# Altium project Kasil_DIOT_x86_board.PrjPcb (part 1 of 4)
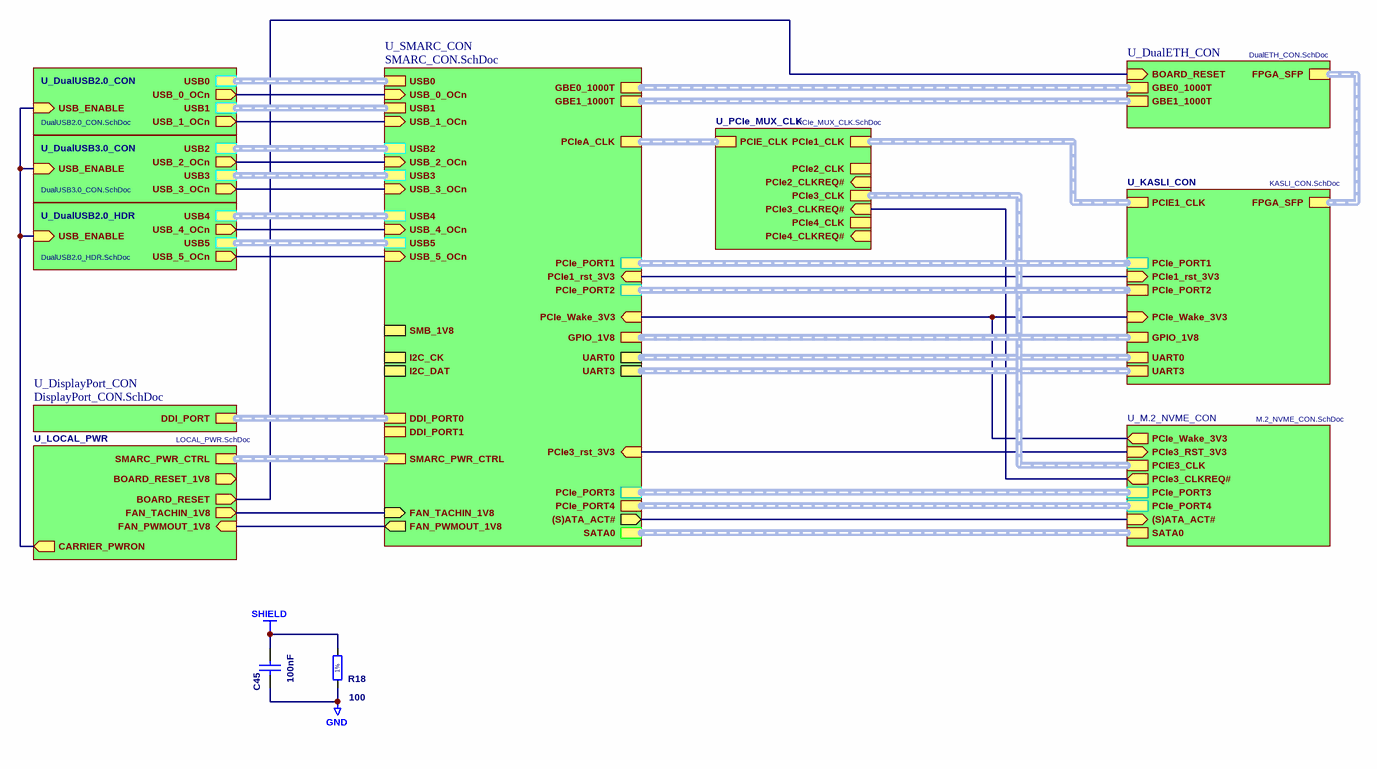
[diagram p0: Kasil_DIOT_x86_board.SchDoc]
11 sheets, 359 parts. Net scope: hierarchical (ports join the sheet entries above them; power ports are global).
Board file: KASLI-DIOT-CPU.PcbDoc
Sheets:
  Kasil_DIOT_x86_board.SchDoc
    U_SMARC_CON = SMARC_CON.SchDoc
    U_DisplayPort_CON = DisplayPort_CON.SchDoc
    U_DualETH_CON = DualETH_CON.SchDoc
    U_DualUSB2.0_CON = DualUSB2.0_CON.SchDoc
    U_DualUSB3.0_CON = DualUSB3.0_CON.SchDoc
    U_LOCAL_PWR = LOCAL_PWR.SchDoc
    U_KASLI_CON = KASLI_CON.SchDoc
    U_M.2_NVME_CON = M.2_NVME_CON.SchDoc
    U_PCIe_MUX_CLK = PCIe_MUX_CLK.SchDoc
    U_DualUSB2.0_HDR = DualUSB2.0_HDR.SchDoc

## Sheet Kasil_DIOT_x86_board.SchDoc
size 420 x 297 mm; SheetNumber: 1; SheetTotal: 11; ModifiedBy: -; CheckedDate: -; Title2: Title 2; DivGrp: WUT ISE; Designer: G.Kasprowicz

### Parts
C45  100nF  [CAPC1005X55N]
R18  100  [RESC1005X40N]

### Sub-sheets
U_DisplayPort_CON = DisplayPort_CON.SchDoc: DDI_PORT (harness DDI_PORT)
U_DualETH_CON = DualETH_CON.SchDoc: GBE0_1000T (harness GBE_copper), GBE1_1000T (harness GBE_copper), FPGA_SFP (harness SFP), BOARD_RESET (in)
U_DualUSB2.0_CON = DualUSB2.0_CON.SchDoc: USB_0_OCn (out), USB1 (harness USB2.0), USB0 (harness USB2.0), USB_1_OCn (out), USB_ENABLE (in)
U_DualUSB2.0_HDR = DualUSB2.0_HDR.SchDoc: USB_5_OCn (out), USB4 (harness USB2.0), USB5 (harness USB2.0), USB_4_OCn (out), USB_ENABLE (in)
U_DualUSB3.0_CON = DualUSB3.0_CON.SchDoc: USB_3_OCn (out), USB3 (harness USB3.0), USB2 (harness USB3.0), USB_2_OCn (out), USB_ENABLE (in)
U_KASLI_CON = KASLI_CON.SchDoc: UART0 (harness UART), UART3 (harness UART), GPIO_1V8 (harness GPIO), PCIE1_CLK (harness CLOCK_DIFF), PCIe_PORT1 (harness PCIe_port), PCIe_PORT2 (harness PCIe_port), FPGA_SFP (harness SFP), PCIe1_rst_3V3 (in), PCIe_Wake_3V3 (in)
U_LOCAL_PWR = LOCAL_PWR.SchDoc: SMARC_PWR_CTRL (harness SMARC_PWR_CTRL), BOARD_RESET (out), BOARD_RESET_1V8 (out), FAN_TACHIN_1V8 (out), FAN_PWMOUT_1V8 (in), CARRIER_PWRON (out)
U_M.2_NVME_CON = M.2_NVME_CON.SchDoc: PCIe3_RST_3V3 (in), PCIe_PORT3 (harness PCIe_port), PCIE3_CLK (harness CLOCK_DIFF), PCIe_PORT4 (harness PCIe_port), PCIe3_CLKREQ# (out), SATA0 (harness SATA), (S)ATA_ACT# (in), PCIe_Wake_3V3 (out)
U_PCIe_MUX_CLK = PCIe_MUX_CLK.SchDoc: PCIE_CLK (harness CLOCK_DIFF), PCIe1_CLK (harness CLOCK_DIFF), PCIe2_CLK (harness CLOCK_DIFF), PCIe3_CLK (harness CLOCK_DIFF), PCIe4_CLK (harness CLOCK_DIFF), PCIe2_CLKREQ# (in), PCIe3_CLKREQ# (in), PCIe4_CLKREQ# (in)
U_SMARC_CON = SMARC_CON.SchDoc: I2C_CK, I2C_DAT, SMB_1V8 (harness SMB), USB_3_OCn (in), USB_0_OCn (in), USB_5_OCn (in), (S)ATA_ACT# (out), USB4 (harness USB2.0), USB5 (harness USB2.0), USB_1_OCn (in), USB_2_OCn (in), USB_4_OCn (in), UART3 (harness UART), UART0 (harness UART), FAN_TACHIN_1V8 (in), FAN_PWMOUT_1V8 (out), PCIe_PORT1 (harness PCIe_port), PCIe_PORT2 (harness PCIe_port), PCIe_PORT3 (harness PCIe_port), USB3 (harness USB3.0), USB2 (harness USB3.0), GBE0_1000T (harness GBE_copper), SATA0 (harness SATA), DDI_PORT0 (harness DDI_PORT), DDI_PORT1 (harness DDI_PORT), SMARC_PWR_CTRL (harness SMARC_PWR_CTRL), GBE1_1000T (harness GBE_copper), PCIeA_CLK (harness CLOCK_DIFF), PCIe_PORT4 (harness PCIe_port), USB0 (harness USB2.0), USB1 (harness USB2.0), PCIe1_rst_3V3 (in), PCIe_Wake_3V3 (in), PCIe3_rst_3V3 (in), GPIO_1V8 (harness GPIO)

### Nets
GND: C45.1 R18.1
SHIELD: C45.2 R18.2
(S)ATA_ACT#: sheet U_SMARC_CON/(S)ATA_ACT#, sheet U_M.2_NVME_CON/(S)ATA_ACT#
BOARD_RESET: sheet U_DualETH_CON/BOARD_RESET, sheet U_LOCAL_PWR/BOARD_RESET
CARRIER_PWRON: sheet U_DualUSB2.0_CON/USB_ENABLE, sheet U_DualUSB3.0_CON/USB_ENABLE, sheet U_LOCAL_PWR/CARRIER_PWRON, sheet U_DualUSB2.0_HDR/USB_ENABLE
PCIe1_rst_3V3: sheet U_SMARC_CON/PCIe1_rst_3V3, sheet U_KASLI_CON/PCIe1_rst_3V3
PCIe3_CLKREQ#: sheet U_M.2_NVME_CON/PCIe3_CLKREQ#, sheet U_PCIe_MUX_CLK/PCIe3_CLKREQ#
PCIe3_RST: sheet U_SMARC_CON/PCIe3_rst_3V3, sheet U_M.2_NVME_CON/PCIe3_RST_3V3
PCIe_Wake_3V3: sheet U_SMARC_CON/PCIe_Wake_3V3, sheet U_KASLI_CON/PCIe_Wake_3V3, sheet U_M.2_NVME_CON/PCIe_Wake_3V3
USB_0_OCn: sheet U_SMARC_CON/USB_0_OCn, sheet U_DualUSB2.0_CON/USB_0_OCn
USB_1_OCn: sheet U_SMARC_CON/USB_1_OCn, sheet U_DualUSB2.0_CON/USB_1_OCn
USB_2_OCn: sheet U_SMARC_CON/USB_2_OCn, sheet U_DualUSB3.0_CON/USB_2_OCn
USB_3_OCn: sheet U_SMARC_CON/USB_3_OCn, sheet U_DualUSB3.0_CON/USB_3_OCn
USB_5_OCn: sheet U_SMARC_CON/USB_5_OCn, sheet U_DualUSB2.0_HDR/USB_5_OCn
NetIC14_5: sheet U_SMARC_CON/USB_4_OCn, sheet U_DualUSB2.0_HDR/USB_4_OCn
NetM1_P113: sheet U_SMARC_CON/FAN_PWMOUT_1V8, sheet U_LOCAL_PWR/FAN_PWMOUT_1V8
NetM1_P114: sheet U_SMARC_CON/FAN_TACHIN_1V8, sheet U_LOCAL_PWR/FAN_TACHIN_1V8

### Buses and harness runs
harness sheet U_DisplayPort_CON/DDI_PORT = sheet U_SMARC_CON/DDI_PORT0
harness sheet U_DualETH_CON/FPGA_SFP = sheet U_KASLI_CON/FPGA_SFP
harness sheet U_DualETH_CON/GBE0_1000T = sheet U_SMARC_CON/GBE0_1000T
harness sheet U_DualETH_CON/GBE1_1000T = sheet U_SMARC_CON/GBE1_1000T
harness sheet U_DualUSB2.0_CON/USB0 = sheet U_SMARC_CON/USB0
harness sheet U_DualUSB2.0_CON/USB1 = sheet U_SMARC_CON/USB1
harness sheet U_DualUSB2.0_HDR/USB4 = sheet U_SMARC_CON/USB4
harness sheet U_DualUSB2.0_HDR/USB5 = sheet U_SMARC_CON/USB5
harness sheet U_DualUSB3.0_CON/USB2 = sheet U_SMARC_CON/USB2
harness sheet U_DualUSB3.0_CON/USB3 = sheet U_SMARC_CON/USB3
harness sheet U_KASLI_CON/GPIO_1V8 = sheet U_SMARC_CON/GPIO_1V8
harness sheet U_KASLI_CON/PCIE1_CLK = sheet U_PCIe_MUX_CLK/PCIe1_CLK
harness sheet U_KASLI_CON/PCIe_PORT1 = sheet U_SMARC_CON/PCIe_PORT1
harness sheet U_KASLI_CON/PCIe_PORT2 = sheet U_SMARC_CON/PCIe_PORT2
harness sheet U_KASLI_CON/UART0 = sheet U_SMARC_CON/UART0
harness sheet U_KASLI_CON/UART3 = sheet U_SMARC_CON/UART3
harness sheet U_LOCAL_PWR/SMARC_PWR_CTRL = sheet U_SMARC_CON/SMARC_PWR_CTRL
harness sheet U_M.2_NVME_CON/PCIE3_CLK = sheet U_PCIe_MUX_CLK/PCIe3_CLK
harness sheet U_M.2_NVME_CON/PCIe_PORT3 = sheet U_SMARC_CON/PCIe_PORT3
harness sheet U_M.2_NVME_CON/PCIe_PORT4 = sheet U_SMARC_CON/PCIe_PORT4
harness sheet U_M.2_NVME_CON/SATA0 = sheet U_SMARC_CON/SATA0
harness sheet U_PCIe_MUX_CLK/PCIE_CLK = sheet U_SMARC_CON/PCIeA_CLK

### Notes on the sheet
- Project/Equipment
- Document
- Designer
- Drawn by
- Check.by
- Copyright WUT ISE 2024.
  This documentation describes Open Hardware and is licensed under the CERN OHL v.2. You may redistribute and modify this documentation under the terms of the CERN OHL v.2. (http://ohwr.org/CERNOHL). This documentation is distributed WITHOUT ANY EXPRESS OR IMPLIED WARRANTY, INCLUDING OF MERCHANTABILITY, SATISFACTORY QUALITY AND FITNESS FOR A PARTICULAR PURPOSE. Please see the CERN OHL v.2 for applicable conditions.
- Contact
- File
- Last Mod.
- Print Date
- Sheet
- Size
- A3
- of
- Rev
- (in symbol R0402_100R_1%_0.0625W_100PPM) 1%

### Library data of the parts
C45 = CC0402_100NF_16V_10%_X7R: Non-polarised capacitor; Part Description: SMD Multilayer Chip Ceramic Capacitor; Manufacturer: GENERIC; Manufacturer1 Part Number: GRM155R71C104KA88D; Voltage: 16V; TC: X7R; Tolerance: ±10%; Part Number: CC0402_100NF_16V_10%_X7R; Component Kind: Standard; Component Type: Standard; Pin Count: 2; Value: 100nF; Status: Not Recommended; Manufacturer Part Number: CC0402_100NF_16V_10%_X7R; Case: 0402; Mounted: Yes; Socket: No; SMD: Yes; Sense: No; Manufacturer1 Example: MURATA; Manufacturer1 ComponentHeight: 0.55mm; HelpURL: \\cern.ch\dfs\Applications\Altium\Datasheets\CC0402_X7R_MURATA_GRM.pdf; Author: CERN DEM JLC; CreateDate: 05/12/2013; LatestRevisionDate: 03/12/2007
R18 = R0402_100R_1%_0.0625W_100PPM: Resistor - 1%; Part Description: General Purpose Thick Film Chip Resistor; Manufacturer: GENERIC; Manufacturer1 Part Number: 232270671001L; TC: ±100ppm/°C; Table: Resistors SMD; Part Number: R0402_100R_1%_0.0625W_100PPM; Component Kind: Standard; Component Type: Standard; Pin Count: 2; Value: 100; Status: Not recommended; Power: 0.0625W; Tolerance: ±1%; Manufacturer Part Number: R0402_100R_1%_0.0625W_100PPM; Case: 0402; Mounted: Yes; Socket: No; SMD: Yes; Manufacturer1 Example: YAGEO PHYCOMP; Manufacturer1 ComponentHeight: 0.4mm; HelpURL: \\cern.ch\dfs\Applications\Altium\Datasheets\R0402_Phycomp_RC0402.pdf; Author: CERN DEM JLC; CreateDate: 2007-12-03; LatestRevisionDate: 2012-10-17

## Sheet SMARC_CON.SchDoc
size 420 x 297 mm; SheetNumber: 2; SheetTotal: 11; ModifiedBy: -; CheckedDate: -; Title2: Title 2; DivGrp: WUT ISE; Designer: A. Bartkowicz
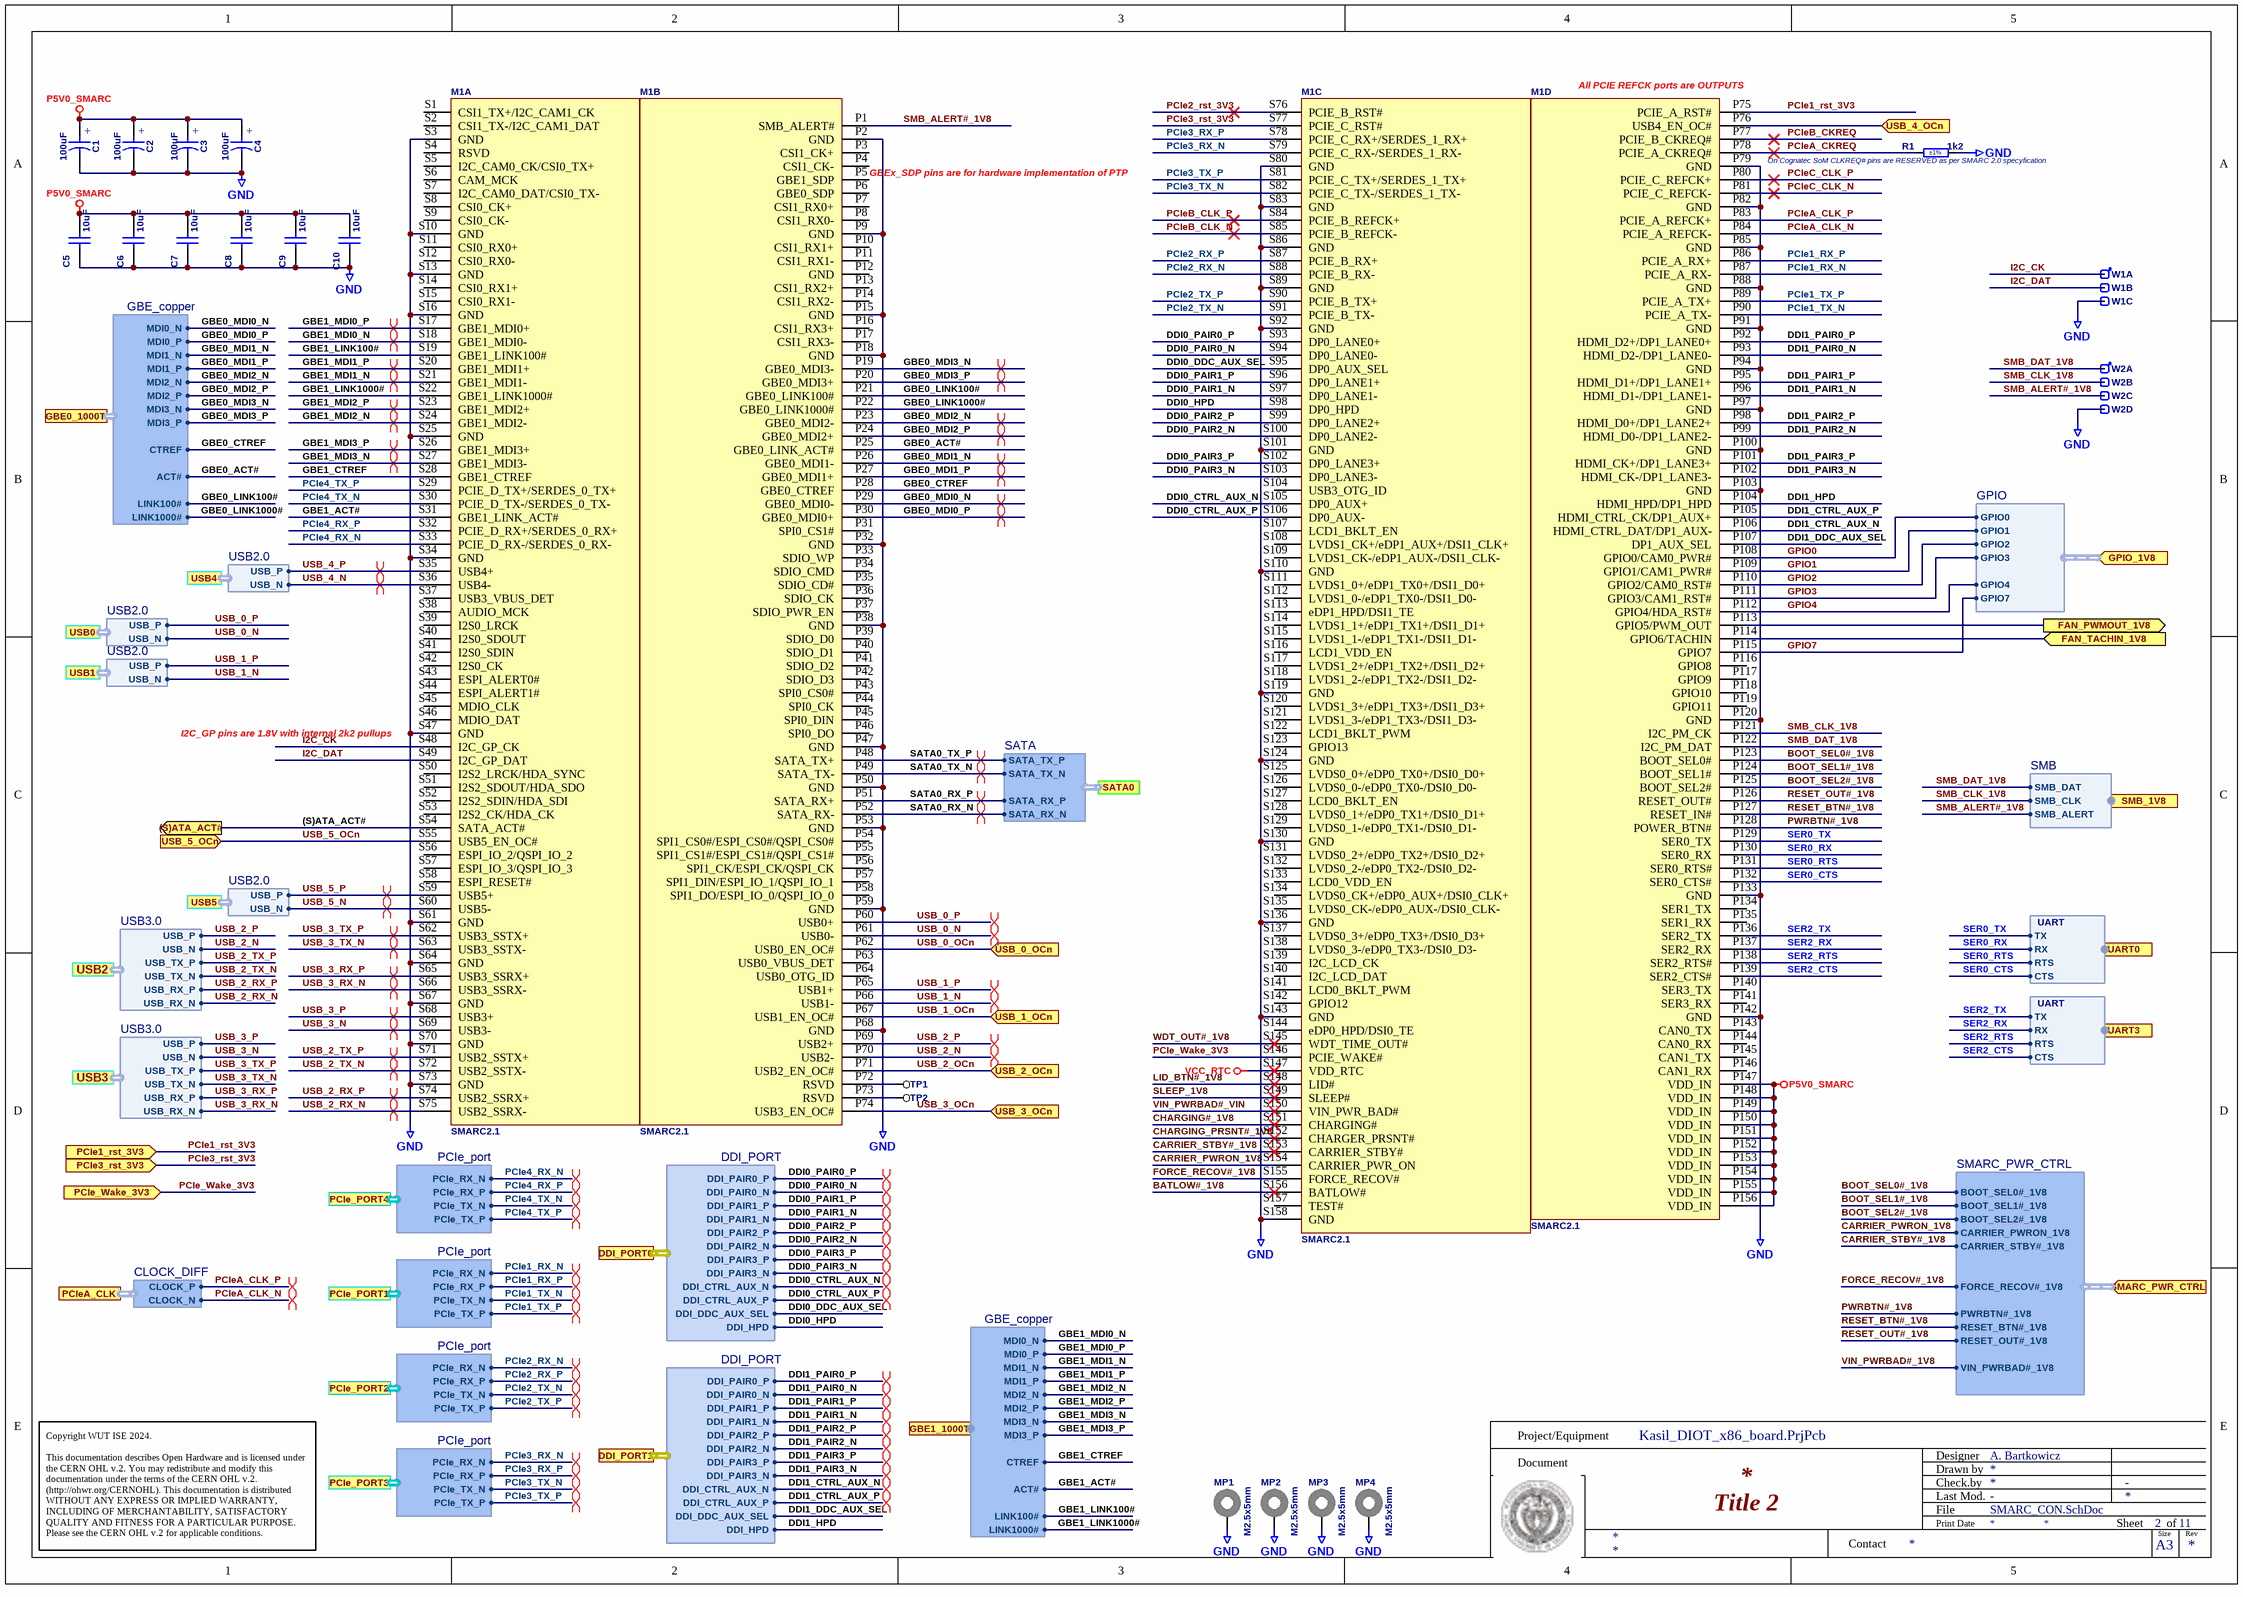
[diagram p1: SMARC_CON.SchDoc]

### Parts
C1  100uF  [CAPMP7343X310N]
C2  100uF  [CAPMP7343X310N]
C3  100uF  [CAPMP7343X310N]
C4  100uF  [CAPMP7343X310N]
C5  10uF  [CAPC1608X80N]
C6  10uF  [CAPC1608X80N]
C7  10uF  [CAPC1608X80N]
C8  10uF  [CAPC1608X80N]
C9  10uF  [CAPC1608X80N]
C10  10uF  [CAPC1608X80N]
M1  SMARC2.1  [SMARC2.1]  (parts A,B,C,D of 4)
MP1  M2.5x5mm  [9774025151]
MP2  M2.5x5mm  [9774025151]
MP3  M2.5x5mm  [9774025151]
MP4  M2.5x5mm  [9774025151]
R1  1k2  Tolerance: ±1%  [RESC1005X40N]
TP1  TP  [TP_large]  (value not drawn)
TP2  TP  [TP_large]  (value not drawn)
W1  Header 3  [SAMTEC_TSW-103-23-L-S]  (value not drawn)  (parts A,B,C of 3)
W2  Header 4  [SAMTEC_TSW-104-23-L-S]  (value not drawn)  (parts A,B,C,D of 4)

### Ports
(S)ATA_ACT# (out), DDI_PORT0 (harness DDI_PORT), DDI_PORT1 (harness DDI_PORT), FAN_PWMOUT_1V8 (out), FAN_TACHIN_1V8 (in), GBE0_1000T (harness GBE_copper), GBE1_1000T (harness GBE_copper), GPIO_1V8 (in, harness GPIO), PCIe1_rst_3V3 (in), PCIe3_rst_3V3 (in), PCIe_PORT1 (harness PCIe_port), PCIe_PORT2 (harness PCIe_port), PCIe_PORT3 (harness PCIe_port), PCIe_PORT4 (harness PCIe_port), PCIe_Wake_3V3 (in), PCIeA_CLK (harness CLOCK_DIFF), SATA0 (harness SATA), SMARC_PWR_CTRL (in, harness SMARC_PWR_CTRL), SMB_1V8 (in, harness SMB), UART0 (harness UART), UART3 (harness UART), USB0 (harness USB2.0), USB1 (harness USB2.0), USB2 (harness USB3.0), USB3 (harness USB3.0), USB4 (harness USB2.0), USB5 (harness USB2.0), USB_0_OCn (in), USB_1_OCn (in), USB_2_OCn (in), USB_3_OCn (in), USB_4_OCn (in), USB_5_OCn (in)

### Harnesses
USB2.0: USB_P, USB_N
CLOCK_DIFF: CLOCK_P, CLOCK_N
PCIe_port: PCIe_TX_P, PCIe_TX_N, PCIe_RX_P, PCIe_RX_N
USB3.0: USB_P, USB_N, USB_TX_P, USB_TX_N, USB_RX_P, USB_RX_N
GBE_copper: MDI2_P, MDI3_N, MDI2_N, MDI3_P, MDI1_P, MDI0_N, MDI1_N, MDI0_P, ACT#, LINK100#, LINK1000#, CTREF
SATA: SATA_TX_N, SATA_TX_P, SATA_RX_N, SATA_RX_P
DDI_PORT: DDI_PAIR0_P, DDI_PAIR0_N, DDI_PAIR1_P, DDI_PAIR1_N, DDI_PAIR2_P, DDI_PAIR2_N, DDI_CTRL_AUX_N, DDI_CTRL_AUX_P, DDI_DDC_AUX_SEL, DDI_HPD, DDI_PAIR3_P, DDI_PAIR3_N
SMARC_PWR_CTRL: BOOT_SEL0#_1V8, BOOT_SEL1#_1V8, BOOT_SEL2#_1V8, CARRIER_PWRON_1V8, CARRIER_STBY#_1V8, FORCE_RECOV#_1V8, PWRBTN#_1V8, RESET_BTN#_1V8, RESET_OUT#_1V8, VIN_PWRBAD#_1V8
UART: TX, RX, RTS, CTS
SMB: SMB_DAT, SMB_CLK, SMB_ALERT
GPIO: GPIO0, GPIO1, GPIO2, GPIO3, GPIO4, GPIO7

### Nets
GND: C1.2 C2.2 C3.2 C4.2 C5.1 C6.1 C7.1 C8.1 C9.1 C10.1 M1.P2(GND) M1.P9(GND) M1.P15(GND) M1.P18(GND) M1.P32(GND) M1.P38(GND) M1.P47(GND) M1.P50(GND) M1.P53(GND) M1.P59(GND) M1.P68(GND) M1.P79(GND) M1.P82(GND) M1.P85(GND) M1.P88(GND) M1.P91(GND) M1.P94(GND) M1.P97(GND) M1.P100(GND) M1.P103(GND) M1.P120(GND) M1.P133(GND) M1.P142(GND) M1.S3(GND) M1.S10(GND) M1.S13(GND) M1.S16(GND) M1.S25(GND) M1.S34(GND) M1.S47(GND) M1.S61(GND) M1.S64(GND) M1.S67(GND) M1.S70(GND) M1.S73(GND) M1.S80(GND) M1.S83(GND) M1.S86(GND) M1.S89(GND) M1.S92(GND) M1.S101(GND) M1.S110(GND) M1.S119(GND) M1.S124(GND) M1.S130(GND) M1.S136(GND) M1.S143(GND) M1.S158(GND) MP1.1 MP2.1 MP3.1 MP4.1 R1.2 W1.3 W2.4
P5V0_SMARC: C1.1 C2.1 C3.1 C4.1 C5.2 C6.2 C7.2 C8.2 C9.2 C10.2 M1.P147(VDD_IN) M1.P148(VDD_IN) M1.P149(VDD_IN) M1.P150(VDD_IN) M1.P151(VDD_IN) M1.P152(VDD_IN) M1.P153(VDD_IN) M1.P154(VDD_IN) M1.P155(VDD_IN) M1.P156(VDD_IN)
VCC_RTC: M1.S147(VDD_RTC)
(S)ATA_ACT#: M1.S54(SATA_ACT#) ; port (S)ATA_ACT#
BATLOW#_1V8: M1.S156(BATLOW#)
BOOT_SEL0#_1V8: M1.P123(BOOT_SEL0#) ; port SMARC_PWR_CTRL.BOOT_SEL0#_1V8
BOOT_SEL1#_1V8: M1.P124(BOOT_SEL1#) ; port SMARC_PWR_CTRL.BOOT_SEL1#_1V8
BOOT_SEL2#_1V8: M1.P125(BOOT_SEL2#) ; port SMARC_PWR_CTRL.BOOT_SEL2#_1V8
CARRIER_PWRON_1V8: M1.S154(CARRIER_PWR_ON) ; port SMARC_PWR_CTRL.CARRIER_PWRON_1V8
CARRIER_STBY#_1V8: M1.S153(CARRIER_STBY#) ; port SMARC_PWR_CTRL.CARRIER_STBY#_1V8
CHARGING#_1V8: M1.S151(CHARGING#)
CHARGING_PRSNT#_1V8: M1.S152(CHARGER_PRSNT#)
DDI0_CTRL_AUX_N: M1.S105(DP0_AUX+) ; port DDI_PORT0.DDI_CTRL_AUX_N
DDI0_CTRL_AUX_P: M1.S106(DP0_AUX-) ; port DDI_PORT0.DDI_CTRL_AUX_P
DDI0_DDC_AUX_SEL: M1.S95(DP0_AUX_SEL) ; port DDI_PORT0.DDI_DDC_AUX_SEL
DDI0_HPD: M1.S98(DP0_HPD) ; port DDI_PORT0.DDI_HPD
DDI0_PAIR0_N: M1.S94(DP0_LANE0-) ; port DDI_PORT0.DDI_PAIR0_N
DDI0_PAIR0_P: M1.S93(DP0_LANE0+) ; port DDI_PORT0.DDI_PAIR0_P
DDI0_PAIR1_N: M1.S97(DP0_LANE1-) ; port DDI_PORT0.DDI_PAIR1_N
DDI0_PAIR1_P: M1.S96(DP0_LANE1+) ; port DDI_PORT0.DDI_PAIR1_P
DDI0_PAIR2_N: M1.S100(DP0_LANE2-) ; port DDI_PORT0.DDI_PAIR2_N
DDI0_PAIR2_P: M1.S99(DP0_LANE2+) ; port DDI_PORT0.DDI_PAIR2_P
DDI0_PAIR3_N: M1.S103(DP0_LANE3-) ; port DDI_PORT0.DDI_PAIR3_N
DDI0_PAIR3_P: M1.S102(DP0_LANE3+) ; port DDI_PORT0.DDI_PAIR3_P
DDI1_CTRL_AUX_N: M1.P106(HDMI_CTRL_DAT/DP1_AUX-) ; port DDI_PORT1.DDI_CTRL_AUX_N
DDI1_CTRL_AUX_P: M1.P105(HDMI_CTRL_CK/DP1_AUX+) ; port DDI_PORT1.DDI_CTRL_AUX_P
DDI1_DDC_AUX_SEL: M1.P107(DP1_AUX_SEL) ; port DDI_PORT1.DDI_DDC_AUX_SEL
DDI1_HPD: M1.P104(HDMI_HPD/DP1_HPD) ; port DDI_PORT1.DDI_HPD
DDI1_PAIR0_N: M1.P93(HDMI_D2-/DP1_LANE0-) ; port DDI_PORT1.DDI_PAIR0_N
DDI1_PAIR0_P: M1.P92(HDMI_D2+/DP1_LANE0+) ; port DDI_PORT1.DDI_PAIR0_P
DDI1_PAIR1_N: M1.P96(HDMI_D1-/DP1_LANE1-) ; port DDI_PORT1.DDI_PAIR1_N
DDI1_PAIR1_P: M1.P95(HDMI_D1+/DP1_LANE1+) ; port DDI_PORT1.DDI_PAIR1_P
DDI1_PAIR2_N: M1.P99(HDMI_D0-/DP1_LANE2-) ; port DDI_PORT1.DDI_PAIR2_N
DDI1_PAIR2_P: M1.P98(HDMI_D0+/DP1_LANE2+) ; port DDI_PORT1.DDI_PAIR2_P
DDI1_PAIR3_N: M1.P102(HDMI_CK-/DP1_LANE3-) ; port DDI_PORT1.DDI_PAIR3_N
DDI1_PAIR3_P: M1.P101(HDMI_CK+/DP1_LANE3+) ; port DDI_PORT1.DDI_PAIR3_P
FORCE_RECOV#_1V8: M1.S155(FORCE_RECOV#) ; port SMARC_PWR_CTRL.FORCE_RECOV#_1V8
GBE0_ACT#: M1.P25(GBE0_LINK_ACT#) ; port GBE0_1000T.ACT#
GBE0_CTREF: M1.P28(GBE0_CTREF) ; port GBE0_1000T.CTREF
GBE0_LINK100#: M1.P21(GBE0_LINK100#) ; port GBE0_1000T.LINK100#
GBE0_LINK1000#: M1.P22(GBE0_LINK1000#) ; port GBE0_1000T.LINK1000#
GBE0_MDI0_N: M1.P29(GBE0_MDI0-) ; port GBE0_1000T.MDI0_N
GBE0_MDI0_P: M1.P30(GBE0_MDI0+) ; port GBE0_1000T.MDI0_P
GBE0_MDI1_N: M1.P26(GBE0_MDI1-) ; port GBE0_1000T.MDI1_N
GBE0_MDI1_P: M1.P27(GBE0_MDI1+) ; port GBE0_1000T.MDI1_P
GBE0_MDI2_N: M1.P23(GBE0_MDI2-) ; port GBE0_1000T.MDI2_N
GBE0_MDI2_P: M1.P24(GBE0_MDI2+) ; port GBE0_1000T.MDI2_P
GBE0_MDI3_N: M1.P19(GBE0_MDI3-) ; port GBE0_1000T.MDI3_N
GBE0_MDI3_P: M1.P20(GBE0_MDI3+) ; port GBE0_1000T.MDI3_P
GBE1_ACT#: M1.S31(GBE1_LINK_ACT#) ; port GBE1_1000T.ACT#
GBE1_CTREF: M1.S28(GBE1_CTREF) ; port GBE1_1000T.CTREF
GBE1_LINK100#: M1.S19(GBE1_LINK100#) ; port GBE1_1000T.LINK100#
GBE1_LINK1000#: M1.S22(GBE1_LINK1000#) ; port GBE1_1000T.LINK1000#
GBE1_MDI0_N: M1.S18(GBE1_MDI0-) ; port GBE1_1000T.MDI0_N
GBE1_MDI0_P: M1.S17(GBE1_MDI0+) ; port GBE1_1000T.MDI0_P
GBE1_MDI1_N: M1.S21(GBE1_MDI1-) ; port GBE1_1000T.MDI1_N
GBE1_MDI1_P: M1.S20(GBE1_MDI1+) ; port GBE1_1000T.MDI1_P
GBE1_MDI2_N: M1.S24(GBE1_MDI2-) ; port GBE1_1000T.MDI2_N
GBE1_MDI2_P: M1.S23(GBE1_MDI2+) ; port GBE1_1000T.MDI2_P
GBE1_MDI3_N: M1.S27(GBE1_MDI3-) ; port GBE1_1000T.MDI3_N
GBE1_MDI3_P: M1.S26(GBE1_MDI3+) ; port GBE1_1000T.MDI3_P
GPIO0: M1.P108(GPIO0/CAM0_PWR#) ; port GPIO_1V8.GPIO0
GPIO1: M1.P109(GPIO1/CAM1_PWR#) ; port GPIO_1V8.GPIO1
GPIO2: M1.P110(GPIO2/CAM0_RST#) ; port GPIO_1V8.GPIO2
GPIO3: M1.P111(GPIO3/CAM1_RST#) ; port GPIO_1V8.GPIO3
GPIO4: M1.P112(GPIO4/HDA_RST#) ; port GPIO_1V8.GPIO4
GPIO7: M1.P115(GPIO7) ; port GPIO_1V8.GPIO7
I2C_CK: M1.S48(I2C_GP_CK) W1.1
I2C_DAT: M1.S49(I2C_GP_DAT) W1.2
LID_BTN#_1V8: M1.S148(LID#)
PCIe1_rst_3V3: M1.P75(PCIE_A_RST#) ; port PCIe1_rst_3V3
PCIe1_RX_N: M1.P87(PCIE_A_RX-) ; port PCIe_PORT1.PCIe_RX_N
PCIe1_RX_P: M1.P86(PCIE_A_RX+) ; port PCIe_PORT1.PCIe_RX_P
PCIe1_TX_N: M1.P90(PCIE_A_TX-) ; port PCIe_PORT1.PCIe_TX_N
PCIe1_TX_P: M1.P89(PCIE_A_TX+) ; port PCIe_PORT1.PCIe_TX_P
PCIe2_rst_3V3: M1.S76(PCIE_B_RST#)
PCIe2_RX_N: M1.S88(PCIE_B_RX-) ; port PCIe_PORT2.PCIe_RX_N
PCIe2_RX_P: M1.S87(PCIE_B_RX+) ; port PCIe_PORT2.PCIe_RX_P
PCIe2_TX_N: M1.S91(PCIE_B_TX-) ; port PCIe_PORT2.PCIe_TX_N
PCIe2_TX_P: M1.S90(PCIE_B_TX+) ; port PCIe_PORT2.PCIe_TX_P
PCIe3_rst_3V3: M1.S77(PCIE_C_RST#) ; port PCIe3_rst_3V3  [project net PCIe3_RST]
PCIe3_RX_N: M1.S79(PCIE_C_RX-/SERDES_1_RX-) ; port PCIe_PORT3.PCIe_RX_N
PCIe3_RX_P: M1.S78(PCIE_C_RX+/SERDES_1_RX+) ; port PCIe_PORT3.PCIe_RX_P
PCIe3_TX_N: M1.S82(PCIE_C_TX-/SERDES_1_TX-) ; port PCIe_PORT3.PCIe_TX_N
PCIe3_TX_P: M1.S81(PCIE_C_TX+/SERDES_1_TX+) ; port PCIe_PORT3.PCIe_TX_P
PCIe4_RX_N: M1.S33(PCIE_D_RX-/SERDES_0_RX-) ; port PCIe_PORT4.PCIe_RX_N
PCIe4_RX_P: M1.S32(PCIE_D_RX+/SERDES_0_RX+) ; port PCIe_PORT4.PCIe_RX_P
PCIe4_TX_N: M1.S30(PCIE_D_TX-/SERDES_0_TX-) ; port PCIe_PORT4.PCIe_TX_N
PCIe4_TX_P: M1.S29(PCIE_D_TX+/SERDES_0_TX+) ; port PCIe_PORT4.PCIe_TX_P
PCIe_Wake_3V3: M1.S146(PCIE_WAKE#) ; port PCIe_Wake_3V3
PCIeA_CKREQ: M1.P78(PCIE_A_CKREQ#) R1.1
PCIeA_CLK_N: M1.P84(PCIE_A_REFCK-) ; port PCIeA_CLK.CLOCK_N  [project net PCIe_CLK_N]
PCIeA_CLK_P: M1.P83(PCIE_A_REFCK+) ; port PCIeA_CLK.CLOCK_P  [project net PCIe_CLK_P]
PCIeB_CKREQ: M1.P77(PCIE_B_CKREQ#)
PCIeB_CLK_N: M1.S85(PCIE_B_REFCK-)
PCIeB_CLK_P: M1.S84(PCIE_B_REFCK+)
PCIeC_CLK_N: M1.P81(PCIE_C_REFCK-)
PCIeC_CLK_P: M1.P80(PCIE_C_REFCK+)
PWRBTN#_1V8: M1.P128(POWER_BTN#) ; port SMARC_PWR_CTRL.PWRBTN#_1V8
RESET_BTN#_1V8: M1.P127(RESET_IN#) ; port SMARC_PWR_CTRL.RESET_BTN#_1V8
RESET_OUT#_1V8: M1.P126(RESET_OUT#) ; port SMARC_PWR_CTRL.RESET_OUT#_1V8
SATA0_RX_N: M1.P52(SATA_RX-) ; port SATA0.SATA_RX_N
SATA0_RX_P: M1.P51(SATA_RX+) ; port SATA0.SATA_RX_P
SATA0_TX_N: M1.P49(SATA_TX-) ; port SATA0.SATA_TX_N
SATA0_TX_P: M1.P48(SATA_TX+) ; port SATA0.SATA_TX_P
SER0_CTS: M1.P132(SER0_CTS#) ; port UART0.CTS
SER0_RTS: M1.P131(SER0_RTS#) ; port UART0.RTS
SER0_RX: M1.P130(SER0_RX) ; port UART0.RX
SER0_TX: M1.P129(SER0_TX) ; port UART0.TX
SER2_CTS: M1.P139(SER2_CTS#) ; port UART3.CTS
SER2_RTS: M1.P138(SER2_RTS#) ; port UART3.RTS
SER2_RX: M1.P137(SER2_RX) ; port UART3.RX
SER2_TX: M1.P136(SER2_TX) ; port UART3.TX
SLEEP_1V8: M1.S149(SLEEP#)
SMB_ALERT#_1V8: M1.P1(SMB_ALERT#) W2.3 ; port SMB_1V8.SMB_ALERT
SMB_CLK_1V8: M1.P121(I2C_PM_CK) W2.2 ; port SMB_1V8.SMB_CLK
SMB_DAT_1V8: M1.P122(I2C_PM_DAT) W2.1 ; port SMB_1V8.SMB_DAT
USB_0_N: M1.P61(USB0-) ; port USB0.USB_N
USB_0_OCn: M1.P62(USB0_EN_OC#) ; port USB_0_OCn
USB_0_P: M1.P60(USB0+) ; port USB0.USB_P
USB_1_N: M1.P66(USB1-) ; port USB1.USB_N
USB_1_OCn: M1.P67(USB1_EN_OC#) ; port USB_1_OCn
USB_1_P: M1.P65(USB1+) ; port USB1.USB_P
USB_2_N: M1.P70(USB2-) ; port USB2.USB_N
USB_2_OCn: M1.P71(USB2_EN_OC#) ; port USB_2_OCn
USB_2_P: M1.P69(USB2+) ; port USB2.USB_P
USB_2_RX_N: M1.S75(USB2_SSRX-) ; port USB2.USB_RX_N
USB_2_RX_P: M1.S74(USB2_SSRX+) ; port USB2.USB_RX_P
USB_2_TX_N: M1.S72(USB2_SSTX-) ; port USB2.USB_TX_N
USB_2_TX_P: M1.S71(USB2_SSTX+) ; port USB2.USB_TX_P
USB_3_N: M1.S69(USB3-) ; port USB3.USB_N
USB_3_OCn: M1.P74(USB3_EN_OC#) ; port USB_3_OCn
USB_3_P: M1.S68(USB3+) ; port USB3.USB_P
USB_3_RX_N: M1.S66(USB3_SSRX-) ; port USB3.USB_RX_N
USB_3_RX_P: M1.S65(USB3_SSRX+) ; port USB3.USB_RX_P
USB_3_TX_N: M1.S63(USB3_SSTX-) ; port USB3.USB_TX_N
USB_3_TX_P: M1.S62(USB3_SSTX+) ; port USB3.USB_TX_P
USB_4_N: M1.S36(USB4-) ; port USB4.USB_N
USB_4_P: M1.S35(USB4+) ; port USB4.USB_P
USB_5_N: M1.S60(USB5-) ; port USB5.USB_N
USB_5_OCn: M1.S55(USB5_EN_OC#) ; port USB_5_OCn
USB_5_P: M1.S59(USB5+) ; port USB5.USB_P
VIN_PWRBAD#_VIN: M1.S150(VIN_PWR_BAD#)
WDT_OUT#_1V8: M1.S145(WDT_TIME_OUT#)
NetIC14_5: M1.P76(USB4_EN_OC#) ; port USB_4_OCn
NetM1_P72: M1.P72(RSVD) TP1.1
NetM1_P73: M1.P73(RSVD) TP2.1
NetM1_P113: M1.P113(GPIO5/PWM_OUT) ; port FAN_PWMOUT_1V8
NetM1_P114: M1.P114(GPIO6/TACHIN) ; port FAN_TACHIN_1V8

Not connected (* = marked no-connect by the designer): M1 P3(CSI1_CK+) P4(CSI1_CK-) P5(GBE1_SDP) P6(GBE0_SDP) P7(CSI1_RX0+) P8(CSI1_RX0-) P10(CSI1_RX1+) P11(CSI1_RX1-) P12(GND) P13(CSI1_RX2+) P14(CSI1_RX2-) P16(CSI1_RX3+) P17(CSI1_RX3-) P31(SPI0_CS1#) P33(SDIO_WP) P34(SDIO_CMD) P35(SDIO_CD#) P36(SDIO_CK) P37(SDIO_PWR_EN) P39(SDIO_D0) P40(SDIO_D1) P41(SDIO_D2) P42(SDIO_D3) P43(SPI0_CS0#) P44(SPI0_CK) P45(SPI0_DIN) P46(SPI0_DO) P54(SPI1_CS0#/ESPI_CS0#/QSPI_CS0#) P55(SPI1_CS1#/ESPI_CS1#/QSPI_CS1#) P56(SPI1_CK/ESPI_CK/QSPI_CK) P57(SPI1_DIN/ESPI_IO_1/QSPI_IO_1) P58(SPI1_DO/ESPI_IO_0/QSPI_IO_0) P63(USB0_VBUS_DET) P64(USB0_OTG_ID) P116(GPIO8) P117(GPIO9) P118(GPIO10) P119(GPIO11) P134(SER1_TX) P135(SER1_RX) P140(SER3_TX) P141(SER3_RX) P143(CAN0_TX) P144(CAN0_RX) P145(CAN1_TX) P146(CAN1_RX) S1(CSI1_TX+/I2C_CAM1_CK) S2(CSI1_TX-/I2C_CAM1_DAT) S4(RSVD) S5(I2C_CAM0_CK/CSI0_TX+) S6(CAM_MCK) S7(I2C_CAM0_DAT/CSI0_TX-) S8(CSI0_CK+) S9(CSI0_CK-) S11(CSI0_RX0+) S12(CSI0_RX0-) S14(CSI0_RX1+) S15(CSI0_RX1-) S37(USB3_VBUS_DET) S38(AUDIO_MCK) S39(I2S0_LRCK) S40(I2S0_SDOUT) S41(I2S0_SDIN) S42(I2S0_CK) S43(ESPI_ALERT0#) S44(ESPI_ALERT1#) S45(MDIO_CLK) S46(MDIO_DAT) S50(I2S2_LRCK/HDA_SYNC) S51(I2S2_SDOUT/HDA_SDO) S52(I2S2_SDIN/HDA_SDI) S53(I2S2_CK/HDA_CK) S56(ESPI_IO_2/QSPI_IO_2) S57(ESPI_IO_3/QSPI_IO_3) S58(ESPI_RESET#) S104(USB3_OTG_ID) S107(LCD1_BKLT_EN) S108(LVDS1_CK+/eDP1_AUX+/DSI1_CLK+) S109(LVDS1_CK-/eDP1_AUX-/DSI1_CLK-) S111(LVDS1_0+/eDP1_TX0+/DSI1_D0+) S112(LVDS1_0-/eDP1_TX0-/DSI1_D0-) S113(eDP1_HPD/DSI1_TE) S114(LVDS1_1+/eDP1_TX1+/DSI1_D1+) S115(LVDS1_1-/eDP1_TX1-/DSI1_D1-) S116(LCD1_VDD_EN) S117(LVDS1_2+/eDP1_TX2+/DSI1_D2+) S118(LVDS1_2-/eDP1_TX2-/DSI1_D2-) S120(LVDS1_3+/eDP1_TX3+/DSI1_D3+) S121(LVDS1_3-/eDP1_TX3-/DSI1_D3-) S122(LCD1_BKLT_PWM) S123(GPIO13) S125(LVDS0_0+/eDP0_TX0+/DSI0_D0+) S126(LVDS0_0-/eDP0_TX0-/DSI0_D0-) S127(LCD0_BKLT_EN) S128(LVDS0_1+/eDP0_TX1+/DSI0_D1+) S129(LVDS0_1-/eDP0_TX1-/DSI0_D1-) S131(LVDS0_2+/eDP0_TX2+/DSI0_D2+) S132(LVDS0_2-/eDP0_TX2-/DSI0_D2-) S133(LCD0_VDD_EN) S134(LVDS0_CK+/eDP0_AUX+/DSI0_CLK+) S135(LVDS0_CK-/eDP0_AUX-/DSI0_CLK-) S137(LVDS0_3+/eDP0_TX3+/DSI0_D3+) S138(LVDS0_3-/eDP0_TX3-/DSI0_D3-) S139(I2C_LCD_CK) S140(I2C_LCD_DAT) S141(LCD0_BKLT_PWM) S142(GPIO12) S144(eDP0_HPD/DSI0_TE) S157(TEST#)

### Layout directives
differential pair: DDI0_CTRL_AUX_N, DDI0_CTRL_AUX_P, DDI0_PAIR0_N, DDI0_PAIR0_P, DDI0_PAIR1_N, DDI0_PAIR1_P, DDI0_PAIR2_N, DDI0_PAIR2_P, DDI0_PAIR3_N, DDI0_PAIR3_P, DDI1_CTRL_AUX_N, DDI1_CTRL_AUX_P, DDI1_PAIR0_N, DDI1_PAIR0_P, DDI1_PAIR1_N, DDI1_PAIR1_P, DDI1_PAIR2_N, DDI1_PAIR2_P, DDI1_PAIR3_N, DDI1_PAIR3_P, GBE0_MDI0_N, GBE0_MDI0_P, GBE0_MDI1_N, GBE0_MDI1_P, GBE0_MDI2_N, GBE0_MDI2_P, GBE0_MDI3_N, GBE0_MDI3_P, GBE1_MDI0_N, GBE1_MDI0_P, GBE1_MDI1_N, GBE1_MDI1_P, GBE1_MDI2_N, GBE1_MDI2_P, GBE1_MDI3_N, GBE1_MDI3_P, PCIe1_RX_N, PCIe1_RX_P, PCIe1_TX_N, PCIe1_TX_P, PCIe2_RX_N, PCIe2_RX_P, PCIe2_TX_N, PCIe2_TX_P, PCIe3_RX_N, PCIe3_RX_P, PCIe3_TX_N, PCIe3_TX_P, PCIe4_RX_N, PCIe4_RX_P, PCIe4_TX_N, PCIe4_TX_P, PCIe_CLK_N, PCIe_CLK_P, SATA0_RX_N, SATA0_RX_P, SATA0_TX_N, SATA0_TX_P, USB_0_N, USB_0_P, USB_1_N, USB_1_P, USB_2_N, USB_2_P, USB_2_RX_N, USB_2_RX_P, USB_2_TX_N, USB_2_TX_P, USB_3_N, USB_3_P, USB_3_RX_N, USB_3_RX_P, USB_3_TX_N, USB_3_TX_P, USB_4_N, USB_4_P, USB_5_N, USB_5_P

### Notes on the sheet
- (near M1) All PCIE REFCK ports are OUTPUTS
- (near M1) GBEx_SDP pins are for hardware implementation of PTP
- (near R1) On Cognatec SoM CLKREQ# pins are RESERVED as per SMARC 2.0 specyfication
- (near M1) I2C_GP pins are 1.8V with internal 2k2 pullups
- Project/Equipment
- Document
- Designer
- Drawn by
- Check.by
- Copyright WUT ISE 2024.
  This documentation describes Open Hardware and is licensed under the CERN OHL v.2. You may redistribute and modify this documentation under the terms of the CERN OHL v.2. (http://ohwr.org/CERNOHL). This documentation is distributed WITHOUT ANY EXPRESS OR IMPLIED WARRANTY, INCLUDING OF MERCHANTABILITY, SATISFACTORY QUALITY AND FITNESS FOR A PARTICULAR PURPOSE. Please see the CERN OHL v.2 for applicable conditions.
- Contact
- File
- Last Mod.
- Print Date
- Sheet
- Size
- A3
- of
- Rev
- (in symbol CTE7343-31_100UF_16V_10%_LESR0100) +

### Library data of the parts
C1-C4 = CTE7343-31_100UF_16V_10%_LESR0100: Polarised capacitor; Part Description: Low ESR 0R1 Solid Tantalum Chip Capacitor; Manufacturer: GENERIC; Manufacturer1 Part Number: TPSD107K016R0100; Voltage: 16V; Tolerance: ±10%; Table: Capacitors SMD; Part Number: CTE7343-31_100UF_16V_10%_LESR0100; Component Kind: Standard; Component Type: Standard; Pin Count: 2; Value: 100uF; Status: Preferred; Manufacturer Part Number: CTE7343-31_100UF_16V_10%_LESR0100; Case: D; Mounted: Yes; Socket: No; SMD: Yes; Manufacturer1 Example: AVX; Manufacturer1 ComponentHeight: 3.1mm; HelpURL: \\cern.ch\dfs\Applications\Altium\Datasheets\CTE-LESR_AVX_TPS.pdf; Author: CERN DEM JLC; CreateDate: 2008-12-15; LatestRevisionDate: 2009-01-20
C5-C10 = CC0603_10UF_16V_20%_X5R: Non-polarised capacitor; Part Description: SMD Multilayer Chip Ceramic Capacitor; Manufacturer: GENERIC; Manufacturer1 Part Number: GRM188R61C106MA73D; Voltage: 16V; TC: X5R; Tolerance: ±20%; Part Number: CC0603_10UF_16V_20%_X5R; Component Kind: Standard; Component Type: Standard; Pin Count: 2; Value: 10uF; Status: None; Manufacturer Part Number: CC0603_10UF_16V_20%_X5R; Case: 0603; Mounted: Yes; Socket: No; SMD: Yes; Sense: No; Manufacturer1 Example: MURATA; Manufacturer1 ComponentHeight: 0.8mm; HelpURL: \\cern.ch\dfs\Applications\Altium\Datasheets\CC0603_X5R_MURATA_GRM.pdf; Author: CERN DEM MR; CreateDate: 02.03.2016; LatestRevisionDate: 02.03.2016
MP1-MP4 = 9774050151R: WA-SMSI SMT Steel Spacer, internal Thread, OD 5.1mm, M2.5x5mm; Manufacturer 1: Wurth Elektronik; Inner Diameter: 3.5mm; Surface: Tin; Thread: M2.5; ComponentLink1Description: Manufacturer; ComponentLink1URL: http://www.we-online.de; ComponentLink2Description: Datasheet; ComponentLink2URL: https://www.we-online.com/catalog/datasheet/9774050151R.pdf; Mounting Technology: SMT; Packaging: Tape and Reel; Manufacturer 1 Part Number: 9774050151R; Length: 5mm; Inner Thread Length: -; Operating Temperature: -55 to +150degC; Outer Diameter: 5.1mm; Published Date: April 2020; Material: Steel
R1 = R0402_1K2_1%_0.0625W_100PPM: Resistor - 1%; Part Description: General Purpose Thick Film Chip Resistor; Manufacturer: GENERIC; Manufacturer 1: YAGEO PHYCOMP; Manufacturer 1 Part Number: 232270671202L; TC: ±100ppm/°C; PressFit: No; Part Number: R0402_1K2_1%_0.0625W_100PPM; Component Kind: Standard; Component Type: Standard; Pin Count: 2; Value: 1k2; Status: Not Recommended; Power: 0.0625W; Manufacturer Part Number: R0402_1K2_1%_0.0625W_100PPM; Case: 0402; Mounted: Yes; Sense: No; Socket: No; SMD: Yes; Manufacturer1 ComponentHeight: 0.4mm; HelpURL: \\cern.ch\dfs\Applications\Altium\Datasheets\R0402_Phycomp_RC0402.pdf; Author: CERN DEM JLC; CreateDate: 03.12.2007; LatestRevisionDate: 17.10.2012
TP1 TP2 = TP: Testpoint
W1 = SAMTEC_TSW-103-23-L-S: 3 Mini Wire-Wrap Contact Strip Header; Part Description: 3 Contacts, Pitch 2.54mm, Single Row  Through Mount Straight Header (Post Lead 5.84mm, Tail Lead 2.92mm, Insulator 2.54mm); Manufacturer: SAMTEC; PressFit: No; Part Number: SAMTEC_TSW-103-23-L-S; Component Kind: Standard; Component Type: Standard; Pin Count: 3; Family: Header 3; Mounted: Yes; Socket: No; SMD: No; Sense: No; Status: None; Manufacturer Part Number: TSW-103-23-L-S; ComponentHeight: 8.38mm; HelpURL: \\cern.ch\dfs\Applications\Altium\Datasheets\SAMTEC_TSW-103-23-L-S.pdf; Author: CERN DEM JLC; CreateDate: 10.10.2012; LatestRevisionDate: 10.10.2012
W2 = SAMTEC_TSW-104-23-L-S: 4 Mini Wire-Wrap Contact Strip Header; Part Description: 4 Contacts, Pitch 2.54mm, Single Row  Through Mount Straight Header (Post Lead 5.84mm, Tail Lead 2.92mm, Insulator 2.54mm); Manufacturer: SAMTEC; PressFit: No; Part Number: SAMTEC_TSW-104-23-L-S; Component Kind: Standard; Component Type: Standard; Pin Count: 4; Family: Header 4; Mounted: Yes; Socket: No; SMD: No; Sense: No; Status: None; Manufacturer Part Number: TSW-104-23-L-S; ComponentHeight: 8.38mm; HelpURL: \\cern.ch\dfs\Applications\Altium\Datasheets\SAMTEC_TSW-104-23-L-S.pdf; Author: CERN DEM JLC; CreateDate: 10.10.2012; LatestRevisionDate: 10.10.2012

## Sheet DisplayPort_CON.SchDoc
size 420 x 297 mm; SheetNumber: 4; SheetTotal: 11; ModifiedBy: -; CheckedDate: -; Title2: Title 2; DivGrp: WUT ISE; Designer: G.Kasprowicz
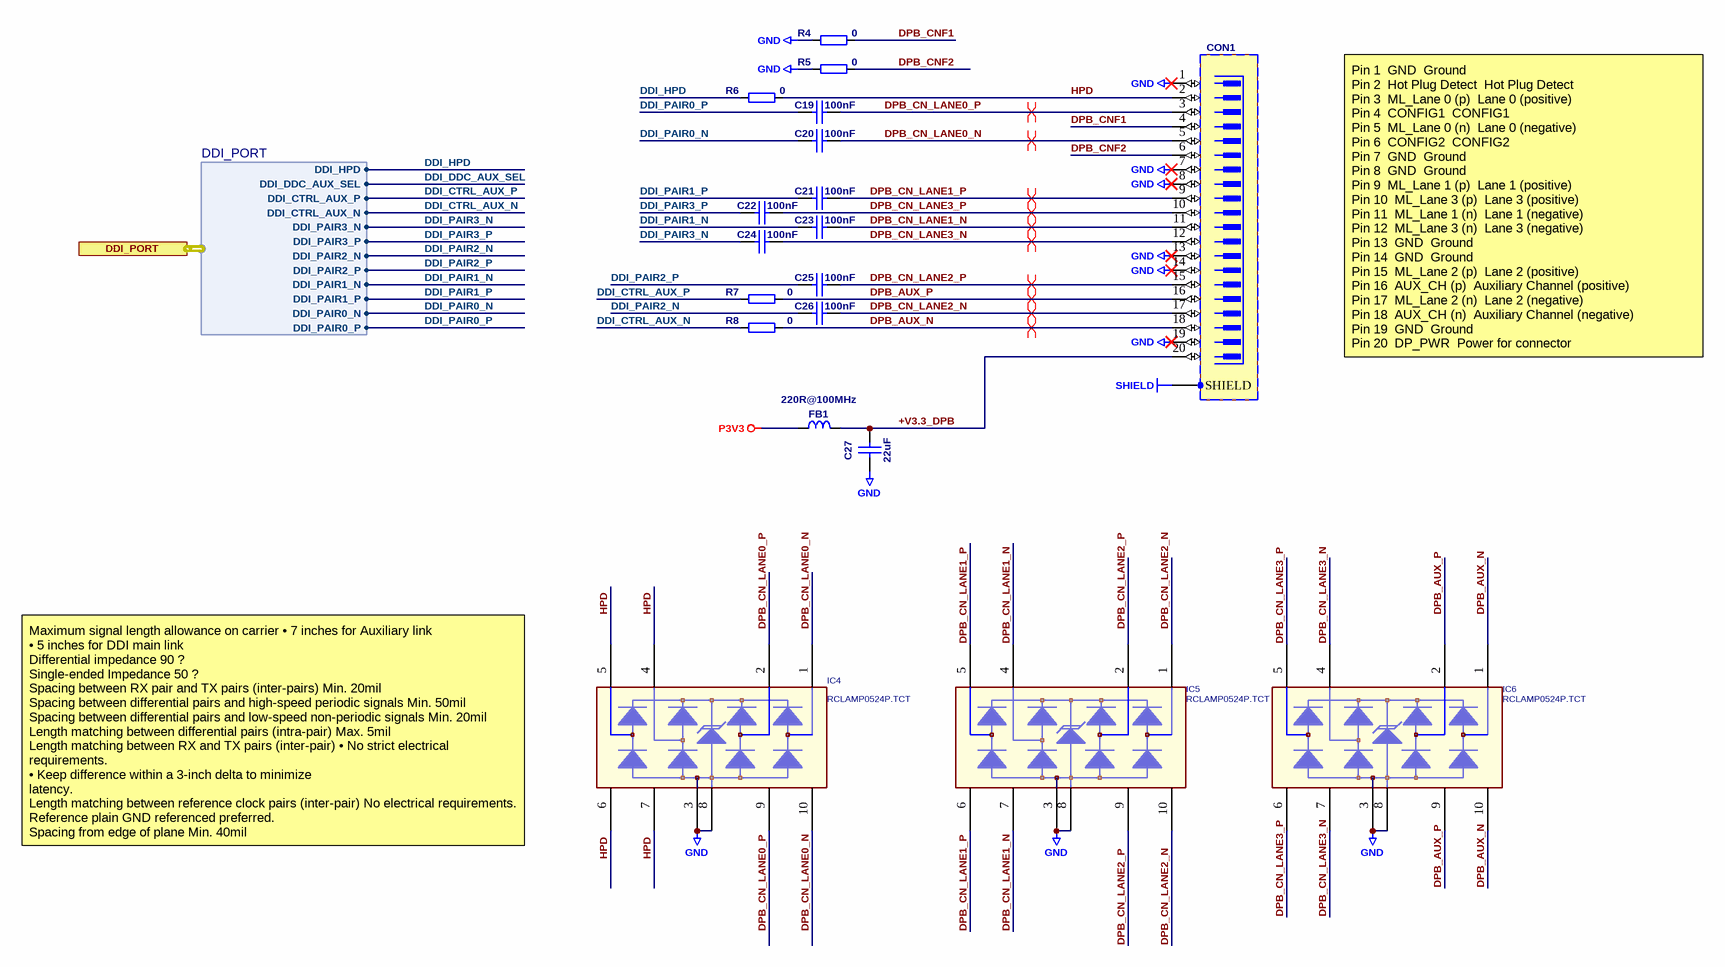
[diagram p2: DisplayPort_CON.SchDoc]

### Parts
C19  100nF  [CAPC1005X55N]
C20  100nF  [CAPC1005X55N]
C21  100nF  [CAPC1005X55N]
C22  100nF  [CAPC1005X55N]
C23  100nF  [CAPC1005X55N]
C24  100nF  [CAPC1005X55N]
C25  100nF  [CAPC1005X55N]
C26  100nF  [CAPC1005X55N]
C27  22uF  [CAPC2012X135N]
CON1  Mini DP  [MULTICOMP_64L020S-3x1N-B]  (value not drawn)
FB1  220R@100MHz  [0603L]
IC4  RCLAMP0524P.TCT  [SMDARRAYC_10P4C]
IC5  RCLAMP0524P.TCT  [SMDARRAYC_10P4C]
IC6  RCLAMP0524P.TCT  [SMDARRAYC_10P4C]
R4  0  [RESC1005X40N]
R5  0  [RESC1005X40N]
R6  0  [RESC1005X40N]
R7  0  [RESC1005X40N]
R8  0  [RESC1005X40N]

### Ports
DDI_PORT (harness DDI_PORT)

### Harnesses
DDI_PORT: DDI_PAIR0_P, DDI_PAIR0_N, DDI_PAIR1_P, DDI_PAIR1_N, DDI_PAIR2_P, DDI_PAIR2_N, DDI_CTRL_AUX_N, DDI_CTRL_AUX_P, DDI_DDC_AUX_SEL, DDI_HPD, DDI_PAIR3_P, DDI_PAIR3_N

### Nets
GND: C27.1 CON1.1 CON1.7 CON1.8 CON1.13 CON1.14 CON1.19 IC4.3 IC4.8 IC5.3 IC5.8 IC6.3 IC6.8 R4.1 R5.1
P3V3: FB1.1
SHIELD: CON1.SHIELD
+V3.3_DPB: C27.2 CON1.20 FB1.2
DDI_CTRL_AUX_N: R8.1 ; port DDI_PORT.DDI_CTRL_AUX_N  [project net DDI0_CTRL_AUX_N]
DDI_CTRL_AUX_P: R7.1 ; port DDI_PORT.DDI_CTRL_AUX_P  [project net DDI0_CTRL_AUX_P]
DDI_HPD: R6.1 ; port DDI_PORT.DDI_HPD  [project net DDI0_HPD]
DDI_PAIR0_N: C20.1 ; port DDI_PORT.DDI_PAIR0_N  [project net DDI0_PAIR0_N]
DDI_PAIR0_P: C19.1 ; port DDI_PORT.DDI_PAIR0_P  [project net DDI0_PAIR0_P]
DDI_PAIR1_N: C23.1 ; port DDI_PORT.DDI_PAIR1_N  [project net DDI0_PAIR1_N]
DDI_PAIR1_P: C21.1 ; port DDI_PORT.DDI_PAIR1_P  [project net DDI0_PAIR1_P]
DDI_PAIR2_N: C26.1 ; port DDI_PORT.DDI_PAIR2_N  [project net DDI0_PAIR2_N]
DDI_PAIR2_P: C25.1 ; port DDI_PORT.DDI_PAIR2_P  [project net DDI0_PAIR2_P]
DDI_PAIR3_N: C24.1 ; port DDI_PORT.DDI_PAIR3_N  [project net DDI0_PAIR3_N]
DDI_PAIR3_P: C22.1 ; port DDI_PORT.DDI_PAIR3_P  [project net DDI0_PAIR3_P]
DPB_AUX_N: CON1.18 IC6.1 IC6.10 R8.2
DPB_AUX_P: CON1.16 IC6.2 IC6.9 R7.2
DPB_CN_LANE0_N: C20.2 CON1.5 IC4.1 IC4.10
DPB_CN_LANE0_P: C19.2 CON1.3 IC4.2 IC4.9
DPB_CN_LANE1_N: C23.2 CON1.11 IC5.4 IC5.7
DPB_CN_LANE1_P: C21.2 CON1.9 IC5.5 IC5.6
DPB_CN_LANE2_N: C26.2 CON1.17 IC5.1 IC5.10
DPB_CN_LANE2_P: C25.2 CON1.15 IC5.2 IC5.9
DPB_CN_LANE3_N: C24.2 CON1.12 IC6.4 IC6.7
DPB_CN_LANE3_P: C22.2 CON1.10 IC6.5 IC6.6
DPB_CNF1: CON1.4 R4.2
DPB_CNF2: CON1.6 R5.2
HPD: CON1.2 IC4.4 IC4.5 IC4.6 IC4.7 R6.2

### Layout directives
differential pair: DPB_AUX_N, DPB_AUX_P, DPB_CN_LANE0_N, DPB_CN_LANE0_P, DPB_CN_LANE1_N, DPB_CN_LANE1_P, DPB_CN_LANE2_N, DPB_CN_LANE2_P, DPB_CN_LANE3_N, DPB_CN_LANE3_P

### Notes on the sheet
- Pin 1 	GND 	Ground
  Pin 2 	Hot Plug Detect 	Hot Plug Detect
  Pin 3 	ML_Lane 0 (p) 	Lane 0 (positive)
  Pin 4 	CONFIG1 	CONFIG1
  Pin 5 	ML_Lane 0 (n) 	Lane 0 (negative)
  Pin 6 	CONFIG2 	CONFIG2
  Pin 7 	GND 	Ground
  Pin 8 	GND 	Ground
  Pin 9 	ML_Lane 1 (p) 	Lane 1 (positive)
  Pin 10 	ML_Lane 3 (p) 	Lane 3 (positive)
  Pin 11 	ML_Lane 1 (n) 	Lane 1 (negative)
  Pin 12 	ML_Lane 3 (n) 	Lane 3 (negative)
  Pin 13 	GND 	Ground
  Pin 14 	GND 	Ground
  Pin 15 	ML_Lane 2 (p) 	Lane 2 (positive)
  Pin 16 	AUX_CH (p) 	Auxiliary Channel (positive)
  Pin 17 	ML_Lane 2 (n) 	Lane 2 (negative)
  Pin 18 	AUX_CH (n) 	Auxiliary Channel (negative)
  Pin 19 	GND 	Ground
  Pin 20 	DP_PWR 	Power for connector
- Maximum signal length allowance on carrier • 7 inches for Auxiliary link
  • 5 inches for DDI main link
  Differential impedance 90 ?
  Single-ended Impedance 50 ?
  Spacing between RX pair and TX pairs (inter-pairs) Min. 20mil
  Spacing between differential pairs and high-speed periodic signals Min. 50mil
  Spacing between differential pairs and low-speed non-periodic signals Min. 20mil
  Length matching between differential pairs (intra-pair) Max. 5mil
  Length matching between RX and TX pairs (inter-pair) • No strict electrical requirements.
  • Keep difference within a 3-inch delta to minimize
  latency.
  Length matching between reference clock pairs (inter-pair) No electrical requirements.
  Reference plain GND referenced preferred.
  Spacing from edge of plane Min. 40mil
- Project/Equipment
- Document
- Designer
- Drawn by
- Check.by
- Copyright WUT ISE 2024.
  This documentation describes Open Hardware and is licensed under the CERN OHL v.2. You may redistribute and modify this documentation under the terms of the CERN OHL v.2. (http://ohwr.org/CERNOHL). This documentation is distributed WITHOUT ANY EXPRESS OR IMPLIED WARRANTY, INCLUDING OF MERCHANTABILITY, SATISFACTORY QUALITY AND FITNESS FOR A PARTICULAR PURPOSE. Please see the CERN OHL v.2 for applicable conditions.
- Contact
- File
- Last Mod.
- Print Date
- Sheet
- Size
- A3
- of
- Rev

### Library data of the parts
C19-C26 = CC0402_100NF_16V_10%_X7R: as C45 on sheet Kasil_DIOT_x86_board; Part Number: CC0402_100NF_16V_10%_X7R; Component Kind: Standard; Component Type: Standard; Pin Count: 2; Value: 100nF; Status: Not Recommended; Manufacturer Part Number: CC0402_100NF_16V_10%_X7R; Case: 0402; Mounted: Yes; Socket: No; SMD: Yes; Sense: No; Manufacturer1 Example: MURATA; Manufacturer1 ComponentHeight: 0.55mm; HelpURL: \\cern.ch\dfs\Applications\Altium\Datasheets\CC0402_X7R_MURATA_GRM.pdf; Author: CERN DEM JLC; CreateDate: 05/12/2013; LatestRevisionDate: 03/12/2007
C27 = CC0805_22UF_16V_10%_X5R: Non-polarised capacitor; Manufacturer: GENERIC; Part Description: SMD Multilayer Chip Ceramic Capacitor; Manufacturer1 Part Number: C2012X5R1C226KT; Tolerance: ±10%; Voltage: 16V; TC: X5R; Manufacturer Part Number: CC0805_22UF_16V_10%_X5R; Part Number: CC0805_22UF_16V_10%_X5R; Value: 22uF; Component Kind: Standard; Component Type: Standard; Pin Count: 2; Status: Preferred; Case: 0805; Mounted: Yes; Socket: No; SMD: Yes; Sense: No; Manufacturer1 Example: TDK; Manufacturer1 ComponentHeight: 1.35mm; HelpURL: \\cern.ch\dfs\Applications\Altium\Datasheets\CC0805_X5R_TDK_C.pdf; Author: CERN DEM JLC; CreateDate: 25.10.2012; LatestRevisionDate: 25.10.2012
CON1 = MULTICOMP_64L020S-331N-B: Connector Mini DisplayPort 20 Male + 1 Shield; Part Description: Mini DisplayPort Receptacle, 20 Positions, Right Angled, Contact Plating 30u" Gold; Manufacturer: FREEPORT; Table: Miscellaneous; Part Number: MULTICOMP_64L020S-331N-B; Component Kind: Standard; Component Type: Standard; Pin Count: 21; Family: Mini DP; Mounted: Yes; Socket: No; SMD: Yes; Status: Not Recommended; Manufacturer Part Number: 64L020S-331N-B; ComponentHeight: 8.2mm; HelpURL: \\cern.ch\dfs\Applications\Altium\Datasheets\MULTICOMP_64L020S-3x1N-B.pdf; Author: CERN DEM JMW; CreateDate: 2012-07-16; LatestRevisionDate: 2012-09-24
FB1 = IND0805_MURATA_BLM21PG221SN1D: Inductor; Part Description: SMD EMIFIL Suppression Chip Bead Ferrite; Manufacturer: MURATA; Power: 2A; Resistance: 0.05R; Tolerance: ±25%; Table: Inductors SMD; Part Number: IND0805_MURATA_BLM21PG221SN1D; Component Kind: Standard; Component Type: Standard; Footprint: INDC2012X105N; Pin Count: 2; Value: 220R@100MHz; Status: None; Manufacturer Part Number: BLM21PG221SN1D; Case: 0805; Mounted: Yes; Socket: No; SMD: Yes; ComponentHeight: 1.05mm; HelpURL: \\cern.ch\dfs\Applications\Altium\Datasheets\IND0402_MURATA_BLM21P.pdf; Author: CERN DEM JLC; CreateDate: 2010-01-25; LatestRevisionDate: 2010-01-25
IC4-IC6 = D_TVS_RCLAMP0524P: DIODE,RCLAMP0524P,SEMTECH; Specification: SMD,ESD COMPONENT,ROHS
R4-R8 = R0402_0R_JUMPER: Resistor; Part Description: 1A (0.05R Max DC Resistance) Zero Ohm Jumper; Manufacturer: GENERIC; Manufacturer1 Part Number: 232270591001L; PressFit: No; Part Number: R0402_0R_JUMPER; Component Kind: Standard; Component Type: Standard; Pin Count: 2; Value: 0; Status: Not Recommended; Manufacturer Part Number: R0402_0R_JUMPER; Case: 0402; Mounted: Yes; Sense: No; Socket: No; SMD: Yes; Manufacturer1 Example: YAGEO PHYCOMP; Manufacturer1 ComponentHeight: 0.4mm; HelpURL: \\cern.ch\dfs\Applications\Altium\Datasheets\R0402_Phycomp_RC0402.pdf; Author: CERN DEM JLC; CreateDate: 03.12.2007; LatestRevisionDate: 17.10.2012